# Altium project CUv4.PrjPcb
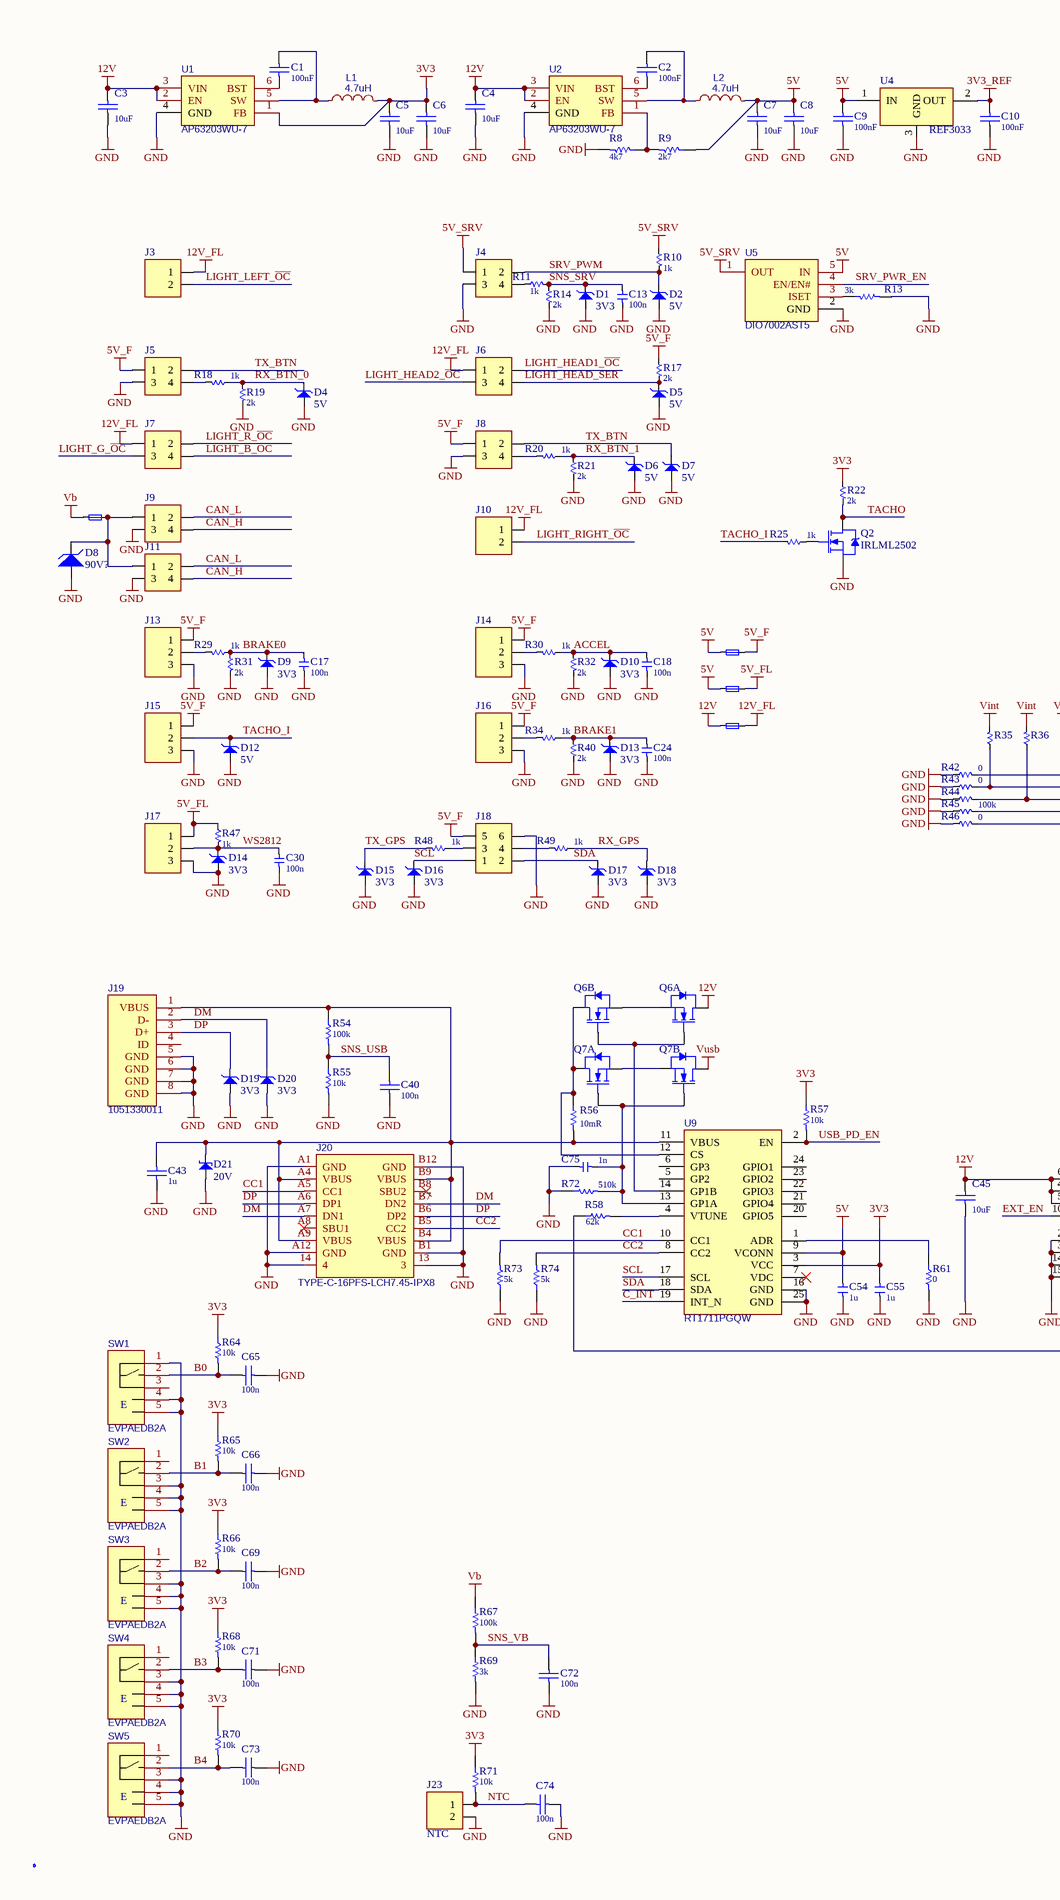
[diagram p0: schematic.SchDoc, left]
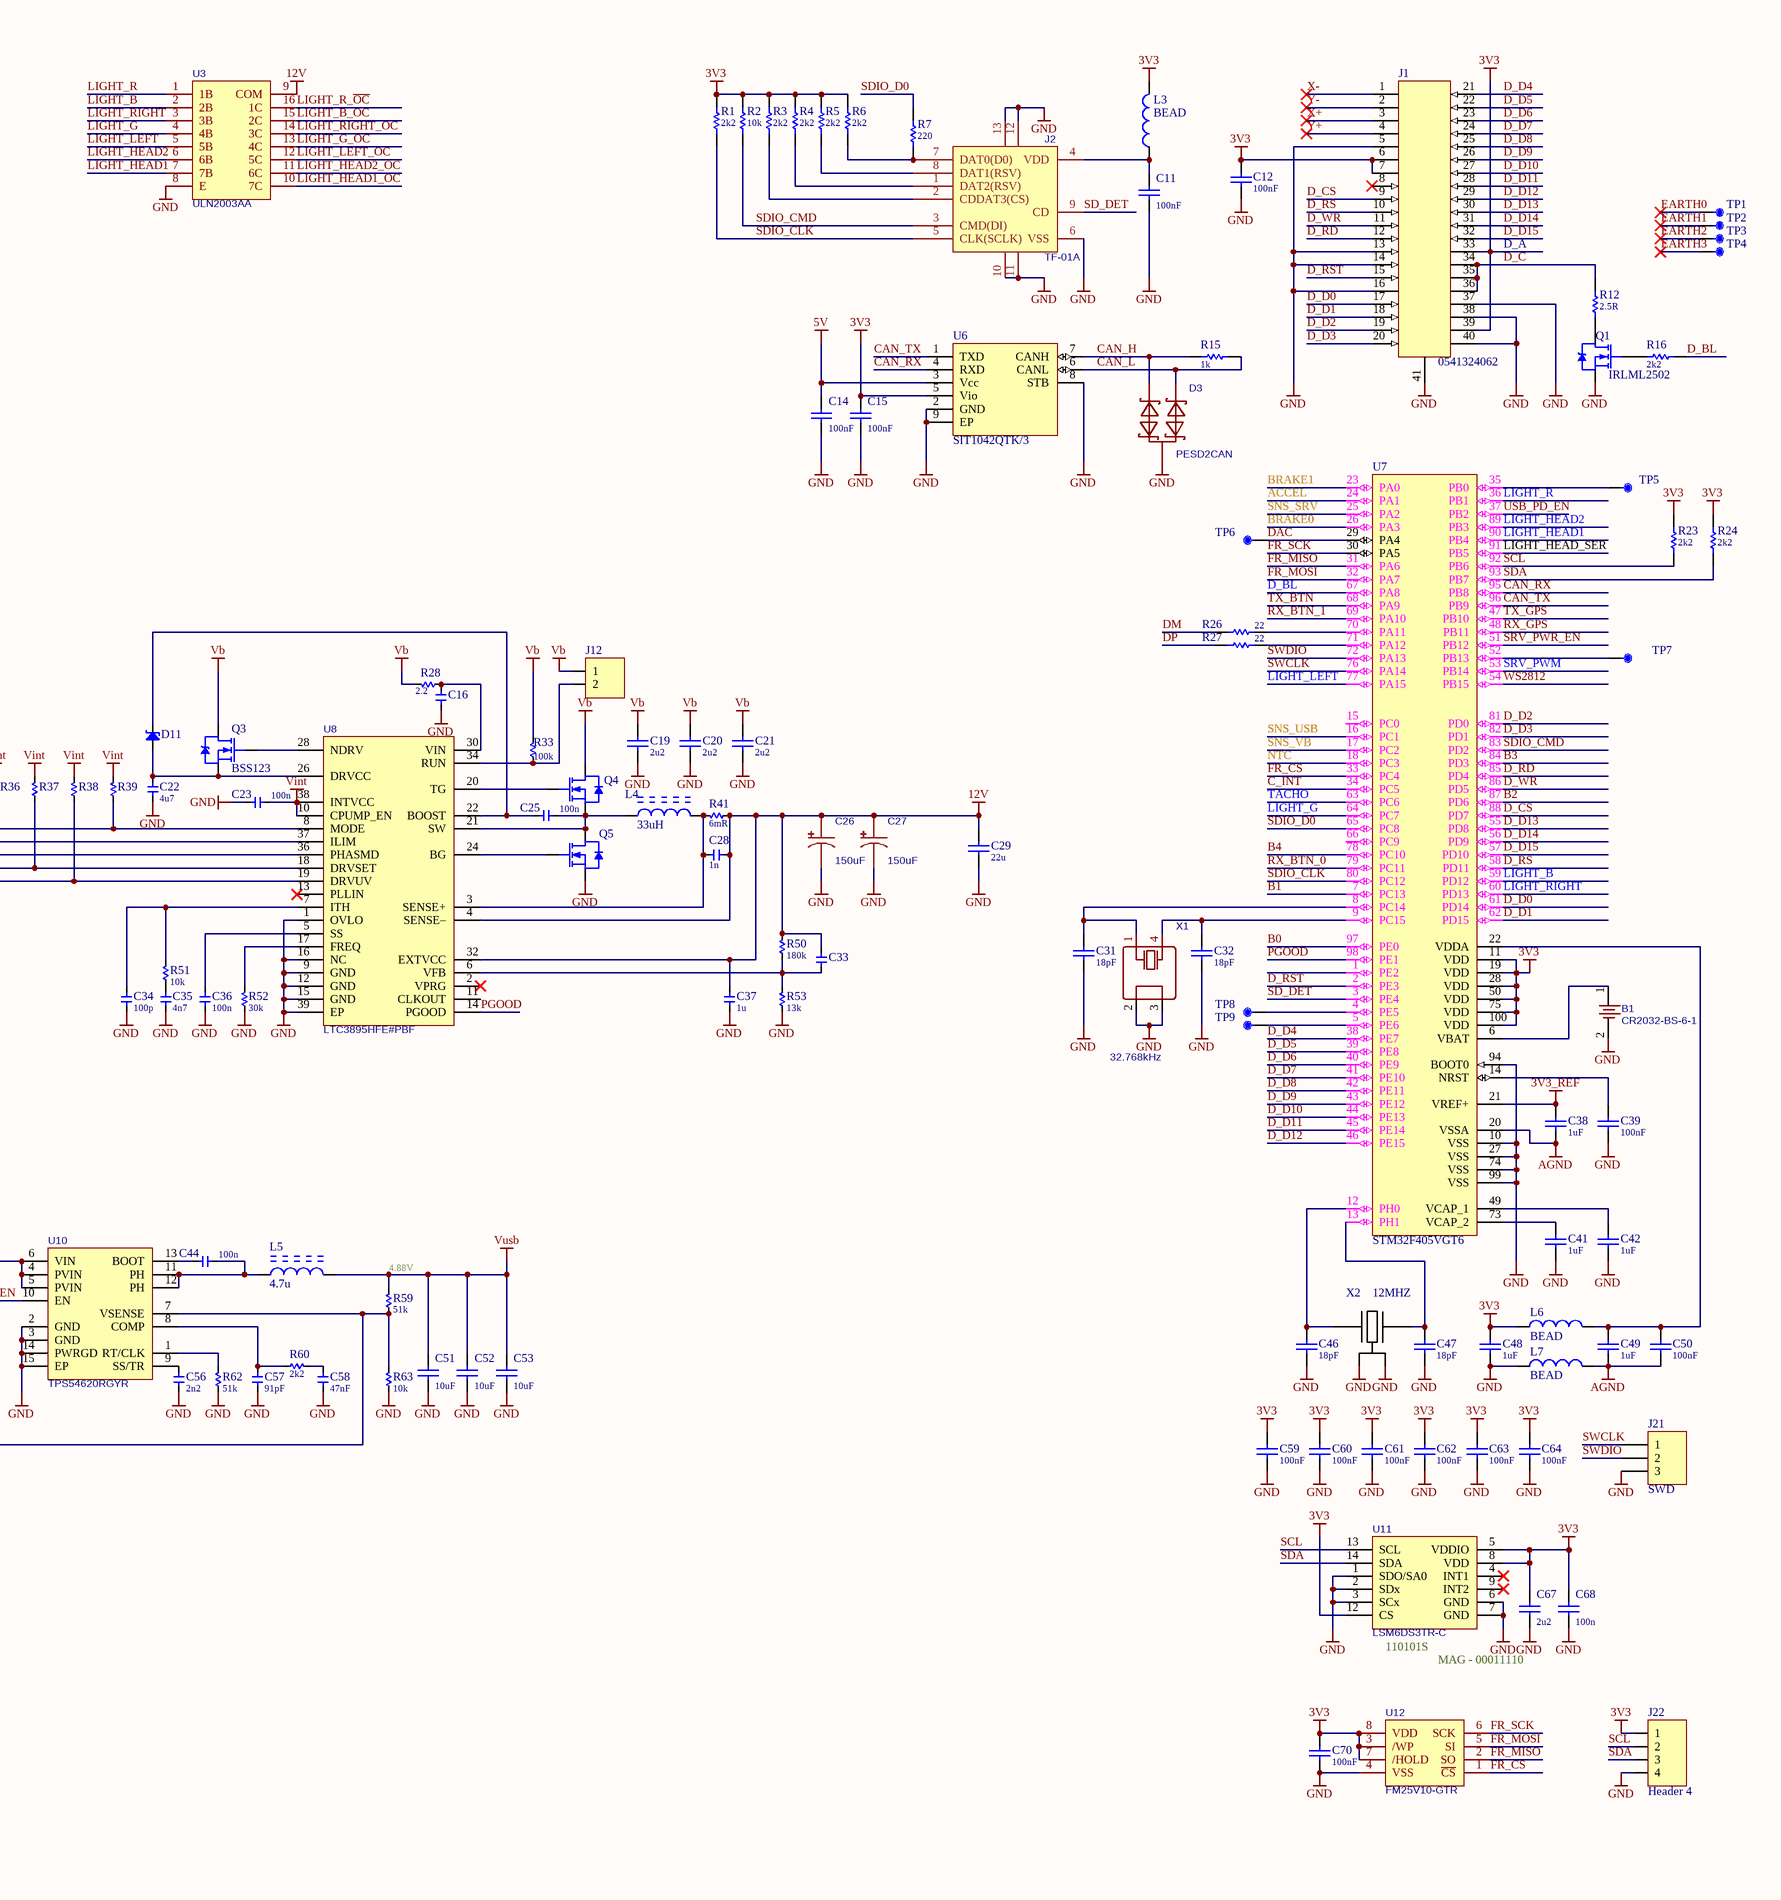
[diagram p1: schematic.SchDoc, right]
PRJ_ID: CU; PRJ_VER: v4.0.0
1 sheet, 241 parts. Net scope: global (net labels, ports and power ports of the same name join across sheets).
Board file: board.PcbDoc

## Sheet schematic.SchDoc
size A2

### Parts
B1  CR2032-BS-6-1  [BAT-TH_CR2032-BS-6-1]
C1  100nF  [C0402]
C2  100nF  [C0402]
C3  10uF  [C1206]
C4  10uF  [C1206]
C5  10uF  [C1206]
C6  10uF  [C1206]
C7  10uF  [C1206]
C8  10uF  [C1206]
C9  100nF  [C0603]
C10  100nF  [C0603]
C11  100nF  [C0402]
C12  100nF  [C0402]
C13  100n  [C0402]
C14  100nF  [C0402]
C15  100nF  [C0402]
C16  (no value)  [C0805]
C17  100n  [C0402]
C18  100n  [C0402]
C19  2u2  [C1210]
C20  2u2  [C1210]
C21  2u2  [C1210]
C22  4u7  [C0805]
C23  100n  [C0603]
C24  100n  [C0402]
C25  100n  [C0603]
C26  150uF  [C7343]
C27  150uF  [C7343]
C28  1n  [C0402]
C29  22u  [C1210]
C30  100n  [C0402]
C31  18pF  [C0402]
C32  18pF  [C0402]
C33  (no value)  [C0402]  (no BOM)
C34  100p  [C0402]
C35  4n7  [C0402]
C36  100n  [C0402]
C37  1u  [C0805]
C38  1uF  [C0603]
C39  100nF  [C0402]
C40  100n  [C0402]
C41  1uF  [C0603]
C42  1uF  [C0603]
C43  1u  [C0603]
C44  100n  [C0402]
C45  10uF  [C1206]
C46  18pF  [C0402]
C47  18pF  [C0402]
C48  1uF  [C0603]
C49  1uF  [C0603]
C50  100nF  [C0402]
C51  10uF  [C1206]
C52  10uF  [C1206]
C53  10uF  [C1206]
C54  1u  [C0402]
C55  1u  [C0402]
C56  2n2  [C0402]
C57  91pF  [C0402]
C58  47nF  [C0402]
C59  100nF  [C0402]
C60  100nF  [C0402]
C61  100nF  [C0402]
C62  100nF  [C0402]
C63  100nF  [C0402]
C64  100nF  [C0402]
C65  100n  [C0402]
C66  100n  [C0402]
C67  2u2  [C0603]
C68  100n  [C0603]
C69  100n  [C0402]
C70  100nF  [C0402]
C71  100n  [C0402]
C72  100n  [C0402]
C73  100n  [C0402]
C74  100n  [C0402]
C75  1n  [C0603]
D1  3V3  [SOD-323]
D2  5V  [SOD-323]
D3  PESD2CAN  [SOT-23]
D4  5V  [SOD-323]
D5  5V  [SOD-323]
D6  5V  [SOD-323]
D7  5V  [SOD-323]
D8  90V?  [SMC]
D9  3V3  [SOD-323]
D10  3V3  [SOD-323]
D11  1N4148WS  [SOD-323]  (value not drawn)
D12  5V  [SOD-323]
D13  3V3  [SOD-323]
D14  3V3  [SOD-323]
D15  3V3  [SOD-323]
D16  3V3  [SOD-323]
D17  3V3  [SOD-323]
D18  3V3  [SOD-323]
D19  3V3  [SOD-323]
D20  3V3  [SOD-323]
D21  20V  [SMA]
F1  1A  [FUSE-1206]  (value not drawn)
F2  1A  [FUSE-1206]  (value not drawn)
F3  1A  [FUSE-1206]  (value not drawn)
F4  2A  [FUSE-1206]  (value not drawn)
J1  0541324062  [*MOLEX_0541324062]
J2  TF-01A  [TF-SMD_TF-01A]
J3  (no value)  [HDR-1X2_2.54]  (no BOM)
J4  (no value)  [HDR-2X2_2.54]  (no BOM)
J5  (no value)  [HDR-2X2_2.54]  (no BOM)
J6  (no value)  [HDR-2X2_2.54]  (no BOM)
J7  (no value)  [HDR-2X2_2.54]  (no BOM)
J8  (no value)  [HDR-2X2_2.54]  (no BOM)
J9  (no value)  [HDR-2X2_2.54]  (no BOM)
J10  (no value)  [HDR-1X2_2.54]  (no BOM)
J11  (no value)  [HDR-2X2_2.54]  (no BOM)
J12  (no value)  [HDR-1x2-P1.25]  (no BOM)
J13  (no value)  [HDR-1X3_2.54]  (no BOM)
J14  (no value)  [HDR-1X3_2.54]  (no BOM)
J15  (no value)  [HDR-1X3_2.54]  (no BOM)
J16  (no value)  [HDR-1X3_2.54]  (no BOM)
J17  (no value)  [HDR-1X3_2.54]  (no BOM)
J18  (no value)  [HDR-2X3_2.54]  (no BOM)
J19  1051330011  [MICRO-USB-SMD_1051330011+]
J20  TYPE-C-16PFS-LCH7.45-IPX8  [USB-TH_TYPE-C-16PFS-LCH7.45-IPX8]
J21  SWD  [HDR-1x3-P1.25]  (no BOM)
J22  Header 4  [HDR-1x4-P1.25]  (no BOM)
J23  NTC  [HDR-1x2-P1.25]  (no BOM)
L1  4.7uH  [IND-SMD_L4.4-W4.2]
L2  4.7uH  [IND-SMD_L4.4-W4.2]
L3  BEAD  [L0603]
L4  33uH  [IND_10X11.5MM]
L5  4.7u  [IND-SMD_L7.2-W6.6_GPSR07X0]
L6  BEAD  [L0402]
L7  BEAD  [L0402]
LOGO1  LOGO  [LOGO]  (value not drawn)  (no BOM)
Q1  IRLML2502  [SOT-23]
Q2  IRLML2502  [SOT-23]
Q3  BSS123  [SOT-23]
Q4  AOD66923  [TO-252AA (DPAK)]  (value not drawn)
Q5  AOD66923  [TO-252AA (DPAK)]  (value not drawn)
Q6  4884  [SO-8]  (value not drawn)  (parts A,B of 2)
Q7  4884  [SO-8]  (value not drawn)  (parts A,B of 2)
R1  2k2  [R0603]
R2  10k  [R0603]
R3  2k2  [R0603]
R4  2k2  [R0603]
R5  2k2  [R0603]
R6  2k2  [R0603]
R7  220  [R0603]
R8  4k7  [R0603]
R9  2k7  [R0603]
R10  1k  [R0402]
R11  1k  [R0402]
R12  2.5R  [R0805]
R13  3k  [R0402]
R14  2k  [R0402]
R15  1k  [R1206]
R16  2k2  [R0402]
R17  2k  [R0402]
R18  1k  [R0402]
R19  2k  [R0402]
R20  1k  [R0402]
R21  2k  [R0402]
R22  2k  [R0402]
R23  2k2  [R0402]
R24  2k2  [R0402]
R25  1k  [R0402]
R26  22  [R0603]
R27  22  [R0603]
R28  2.2  [R0603]
R29  1k  [R0402]
R30  1k  [R0402]
R31  2k  [R0402]
R32  2k  [R0402]
R33  100k  [R0603]
R34  1k  [R0402]
R35  (no value)  [R0603]  (no BOM)
R36  (no value)  [R0603]  (no BOM)
R37  (no value)  [R0603]  (no BOM)
R38  (no value)  [R0603]  (no BOM)
R39  (no value)  [R0603]  (no BOM)
R40  2k  [R0402]
R41  6mR  [R2512-WIDE]
R42  0  [R0603]
R43  0  [R0603]
R44  (no value)  [R0603]  (no BOM)
R45  100k  [R0603]
R46  0  [R0603]
R47  1k  [R0402]
R48  1k  [R0402]
R49  1k  [R0402]
R50  180k  [R0603]
R51  10k  [R0603]
R52  30k  [R0603]
R53  13k  [R0603]
R54  100k  [R0603]
R55  10k  [R0603]
R56  10mR  [R1206]
R57  10k  [R0402]
R58  62k  [R0402]
R59  51k  [R0603]
R60  2k2  [R0402]
R61  0  [R0402]
R62  51k  [R0603]
R63  10k  [R0603]
R64  10k  [R0402]
R65  10k  [R0402]
R66  10k  [R0402]
R67  100k  [R0603]
R68  10k  [R0402]
R69  3k  [R0402]
R70  10k  [R0402]
R71  10k  [R0402]
R72  510k  [R0603]
R73  5k  [R0603]
R74  5k  [R0603]
SW1  EVPAEDB2A  [KEY-SMD_EVPAEBB2A]
SW2  EVPAEDB2A  [KEY-SMD_EVPAEBB2A]
SW3  EVPAEDB2A  [KEY-SMD_EVPAEBB2A]
SW4  EVPAEDB2A  [KEY-SMD_EVPAEBB2A]
SW5  EVPAEDB2A  [KEY-SMD_EVPAEBB2A]
TP1  (no value)  [TP30_SMD]  (no BOM)
TP2  (no value)  [TP30_SMD]  (no BOM)
TP3  (no value)  [TP30_SMD]  (no BOM)
TP4  (no value)  [TP30_SMD]  (no BOM)
TP5  (no value)  [TP30_SMD]  (no BOM)
TP6  (no value)  [TP30_SMD]  (no BOM)
TP7  (no value)  [TP30_SMD]  (no BOM)
TP8  (no value)  [TP30_SMD]  (no BOM)
TP9  (no value)  [TP30_SMD]  (no BOM)
U1  AP63203WU-7  [SOT-23-6]
U2  AP63203WU-7  [SOT-23-6]
U3  ULN2003AA  [SOIC-16]
U4  REF3033  [SOT-23]
U5  DIO7002AST5  [SOT-23-5]
U6  SIT1042QTK/3  [DFN8_3X3_P065]
U7  STM32F405VGT6  [*QFP50P1600X1600X160-100N]
U8  LTC3895HFE#PBF  [TSSOP-38_L9.7-W4.4-P0.50-LS6.4-BL-EP-PE]
U9  RT1711PGQW  [TQFN-24_L3.5-W3.5-P0.40-TL-EP2.0]
U10  TPS54620RGYR  [VQFN-14_L3.5-W3.5-P0.50-BL-EP_TPS54622RHLT]
U11  LSM6DS3TR-C  [LGA-14_L3.0-W2.5-P0.50-TL]
U12  FM25V10-GTR  [SOIC-8]
X1  32.768kHz  [MC-146]
X2  12MHZ  [CRYSTAL_3.2x2.5mm]

### Nets
3V3: C5.2 C6.2 C12.2 C15.2 C48.2 C55.1 C59.2 C60.2 C61.2 C62.2 C63.2 C64.2 C67.1 C68.1 C70.2 J1.6 J1.7 J1.33 J1.39 J22.1 L1.2 L3.1 L6.1 R1.2 R2.2 R3.2 R4.2 R5.2 R6.2 R22.2 R23.2 R24.2 R57.1 R64.1 R65.1 R66.1 R68.1 R70.1 R71.1 U1.1(FB) U6.5(Vio) U7.11(VDD) U7.19(VDD) U7.28(VDD) U7.50(VDD) U7.75(VDD) U7.100(VDD) U9.3(VCC) U11.5(VDDIO) U11.8(VDD) U11.12(CS) U12.3(/WP) U12.7(/HOLD) U12.8(VDD)
3V3_REF: C10.2 C38.2 U4.2(OUT) U7.21(VREF+)
5V: C7.2 C8.2 C9.2 C14.2 C54.1 F2.1 F3.1 L2.2 R9.1 U4.1(IN) U5.5(IN) U6.3(Vcc) U9.9(VCONN)
5V_F: F2.2 J5.1 J8.1 J13.1 J14.1 J15.1 J16.1 J18.5 R17.2
5V_FL: F3.2 J17.1 R47.2
5V_SRV: J4.1 R10.2 U5.1(OUT)
12V: C3.2 C4.2 C26.1 C27.1 C28.1 C29.2 C33.1 C37.1 C45.2 F4.1 Q6.7,8(D1) R41.2 R50.1 U1.2(EN) U1.3(VIN) U2.2(EN) U2.3(VIN) U3.9(COM) U8.4(SENSE–) U8.32(EXTVCC) U10.4(PVIN) U10.5(PVIN) U10.6(VIN)
12V_FL: F4.2 J3.1 J6.1 J7.1 J10.1
AGND: C38.1 C49.1 C50.1 L7.2 U7.20(VSSA)
GND: B1.2 C3.1 C4.1 C5.1 C6.1 C7.1 C8.1 C9.1 C10.1 C11.1 C12.1 C13.1 C14.1 C15.1 C16.2 C17.1 C18.1 C19.1 C20.1 C21.1 C22.2 C23.1 C24.1 C26.2 C27.2 C29.1 C30.1 C31.1 C32.1 C34.2 C35.2 C36.2 C37.2 C39.1 C40.1 C41.1 C42.1 C43.1 C45.1 C46.1 C47.1 C48.1 C51.1 C52.1 C53.1 C54.2 C55.2 C56.2 C57.2 C58.2 C59.1 C60.1 C61.1 C62.1 C63.1 C64.1 C65.2 C66.2 C67.2 C68.2 C69.2 C70.1 C71.2 C72.1 C73.2 C74.1 C75.1 D1.1(-) D2.1(-) D3.3 D4.1(-) D5.1(-) D6.1(-) D7.1(-) D8.1(A) D9.1(-) D10.1(-) D12.1(-) D13.1(-) D14.1(-) D15.1(-) D16.1(-) D17.1(-) D18.1(-) D19.1(-) D20.1(-) D21.1(-) J1.5 J1.13 J1.14 J1.16 J1.37 J1.38 J1.40 J1.41 J2.6(VSS) J2.10(GND) J2.11(GND) J2.12(GND) J2.13(GND) J4.3 J5.3 J8.3 J9.3 J11.3 J13.3 J14.3 J15.3 J16.3 J17.3 J18.6 J19.5(GND) J19.6(GND) J19.7(GND) J19.8(GND) J20.13(3) J20.14(4) J20.A1(GND) J20.A12(GND) J20.B1(GND) J20.B12(GND) J21.3 J22.4 J23.2 L7.1 Q1.2(S) Q2.2(S) Q5.3(SOURCE) R8.2 R13.2 R14.1 R19.1 R21.1 R31.1 R32.1 R40.1 R42.2 R43.2 R44.2 R45.2 R46.2 R52.2 R53.2 R55.2 R61.2 R62.1 R63.2 R69.2 R72.1 R73.1 R74.1 SW1.1 SW1.4 SW1.5 SW2.3 SW2.4 SW2.5 SW3.3 SW3.4 SW3.5 SW4.3 SW4.4 SW4.5 SW5.3 SW5.4 SW5.5 U1.4(GND) U2.4(GND) U3.8(E) U4.3(GND) U5.2(GND) U6.2(GND) U6.8(STB) U6.9(EP) U7.10(VSS) U7.27(VSS) U7.74(VSS) U7.94(BOOT0) U7.99(VSS) U8.1(OVLO) U8.9(GND) U8.12(GND) U8.15(GND) U8.16(NC) U8.39(EP) U9.16(GND) U9.25(GND) U10.2(GND) U10.3(GND) U10.14(PWRGD) U10.15(EP) U11.1(SDO/SA0) U11.2(SDx) U11.3(SCx) U11.6(GND) U11.7(GND) U12.4(VSS) X1.2 X1.3 X2.2(GND) X2.4(GND)
Vb: C19.2 C20.2 C21.2 F1.1 J12.1 Q3.3(D) Q4.2(DRAIN) R28.1 R33.1 R67.1
Vint: C23.2 R35.1 R36.1 R37.1 R38.1 R39.1 U8.10(CPUMP_EN) U8.38(INTVCC)
Vusb: C51.2 C52.2 C53.2 L5.2 Q7.5,6(D2) R59.1
ACCEL: C18.2 D10.2(+) R30.2 R32.2 U7.24(PA1)
B0: C65.1 R64.2 SW1.2 U7.97(PE0)
B1: C66.1 R65.2 SW2.2 U7.7(PC13)
B2: C69.1 R66.2 SW3.2 U7.87(PD6)
B3: C71.1 R68.2 SW4.2 U7.84(PD3)
B4: C73.1 R70.2 SW5.2 U7.78(PC10)
BRAKE0: C17.2 D9.2(+) R29.2 R31.2 U7.26(PA3)
BRAKE1: C24.2 D13.2(+) R34.2 R40.2 U7.23(PA0)
C_INT: U7.34(PC5) U9.19(INT_N)
CAN_H: D3.1 J9.4 J11.4 R15.2 U6.7(CANH)
CAN_L: D3.2 J9.2 J11.2 R15.1 U6.6(CANL)
CAN_RX: U6.4(RXD) U7.95(PB8)
CAN_TX: U6.1(TXD) U7.96(PB9)
CC1: J20.A5(CC1) R73.2 U9.10(CC1)
CC2: J20.B5(CC2) R74.2 U9.8(CC2)
D_BL: R16.1 U7.67(PA8)
D_C: J1.34 J1.35 J1.36 R12.1
D_CS: J1.9 U7.88(PD7)
D_D0: J1.17 U7.61(PD14)
D_D1: J1.18 U7.62(PD15)
D_D2: J1.19 U7.81(PD0)
D_D3: J1.20 U7.82(PD1)
D_D4: J1.21 U7.38(PE7)
D_D5: J1.22 U7.39(PE8)
D_D6: J1.23 U7.40(PE9)
D_D7: J1.24 U7.41(PE10)
D_D8: J1.25 U7.42(PE11)
D_D9: J1.26 U7.43(PE12)
D_D10: J1.27 U7.44(PE13)
D_D11: J1.28 U7.45(PE14)
D_D12: J1.29 U7.46(PE15)
D_D13: J1.30 U7.55(PD8)
D_D14: J1.31 U7.56(PD9)
D_D15: J1.32 U7.57(PD10)
D_RD: J1.12 U7.85(PD4)
D_RS: J1.10 U7.58(PD11)
D_RST: J1.15 U7.2(PE3)
D_WR: J1.11 U7.86(PD5)
DAC: TP6.1 U7.29(PA4)
DM: D20.2(+) J19.2(D-) J20.A7(DN1) J20.B7(DN2) R26.2
DP: D19.2(+) J19.3(D+) J20.A6(DP1) J20.B6(DP2) R27.2
EARTH0: TP1.1
EARTH1: TP2.1
EARTH2: TP3.1
EARTH3: TP4.1
EXT_EN: U10.10(EN)
FR_CS: U7.33(PC4) U12.1(~{CS})
FR_MISO: U7.31(PA6) U12.2(SO)
FR_MOSI: U7.32(PA7) U12.5(SI)
FR_SCK: U7.30(PA5) U12.6(SCK)
LIGHT_B: U3.2(2B) U7.59(PD12)
LIGHT_B_~{OC}: J7.4 U3.15(2C)
LIGHT_G: U3.4(4B) U7.64(PC7)
LIGHT_G_~{OC}: J7.3 U3.13(4C)
LIGHT_HEAD1: U3.7(7B) U7.90(PB4)
LIGHT_HEAD1_~{OC}: J6.2 U3.10(7C)
LIGHT_HEAD2: U3.6(6B) U7.89(PB3)
LIGHT_HEAD2_~{OC}: J6.3 U3.11(6C)
LIGHT_HEAD_SER: D5.2(+) J6.4 R17.1 U7.91(PB5)
LIGHT_LEFT: U3.5(5B) U7.77(PA15)
LIGHT_LEFT_~{OC}: J3.2 U3.12(5C)
LIGHT_R: U3.1(1B) U7.36(PB1)
LIGHT_R_~{OC}: J7.2 U3.16(1C)
LIGHT_RIGHT: U3.3(3B) U7.60(PD13)
LIGHT_RIGHT_~{OC}: J10.2 U3.14(3C)
NTC: C74.2 J23.1 R71.2 U7.18(PC3)
PGOOD: U7.98(PE1) U8.14(PGOOD)
RX_BTN_0: D4.2(+) R18.2 R19.2 U7.79(PC11)
RX_BTN_1: D6.2(+) R20.2 R21.2 U7.69(PA10)
RX_GPS: D18.2(+) R49.2 U7.48(PB11)
SCL: D16.2(+) J18.1 J22.2 R23.1 U7.92(PB6) U9.17(SCL) U11.13(SCL)
SD_DET: J2.9(CD) U7.3(PE4)
SDA: D17.2(+) J18.2 J22.3 R24.1 U7.93(PB7) U9.18(SDA) U11.14(SDA)
SDIO_CLK: J2.5(CLK(SCLK)) R1.1 U7.80(PC12)
SDIO_CMD: J2.3(CMD(DI)) R2.1 U7.83(PD2)
SDIO_D0: R7.2 U7.65(PC8)
SNS_SRV: C13.2 D1.2(+) R11.1 R14.2 U7.25(PA2)
SNS_USB: C40.2 R54.2 R55.1 U7.16(PC1)
SNS_VB: C72.2 R67.2 R69.1 U7.17(PC2)
SRV_PWM: D2.2(+) J4.2 R10.1 U7.53(PB14)
SRV_PWR_EN: U5.4(EN/EN#) U7.51(PB12)
SWCLK: J21.1 U7.76(PA14)
SWDIO: J21.2 U7.72(PA13)
TACHO: Q2.3(D) R22.1 U7.63(PC6)
TACHO_I: D12.2(+) J15.2 R25.1
TX_BTN: D7.2(+) J5.2 J8.2 U7.68(PA9)
TX_GPS: D15.2(+) R48.1 U7.47(PB10)
USB_PD_EN: R57.2 U7.37(PB2) U9.2(EN)
WS2812: C30.2 D14.2(+) J17.2 R47.1 U7.54(PB15)
X+: J1.3
X-: J1.1
Y+: J1.4
Y-: J1.2
NetB1_1: B1.1 U7.6(VBAT)
NetC1_1: C1.1 U1.6(BST)
NetC1_2: C1.2 L1.1 U1.5(SW)
NetC2_1: C2.1 U2.6(BST)
NetC2_2: C2.2 L2.1 U2.5(SW)
NetC11_2: C11.2 J2.4(VDD) L3.2
NetC16_1: C16.1 R28.2 U8.30(VIN)
NetC22_1: C22.1 D11.1(-) Q3.2(S) U8.26(DRVCC)
NetC25_1: C25.1 L4.1 Q4.3(SOURCE) Q5.2(DRAIN) U8.21(SW)
NetC25_2: C25.2 D11.2(+) U8.22(BOOST)
NetC28_2: C28.2 L4.2 R41.1 U8.3(SENSE+)
NetC31_2: C31.2 U7.8(PC14) X1.1(OSC1)
NetC32_2: C32.2 U7.9(PC15) X1.4(OSC2)
NetC33_2: C33.2 R50.2 R53.1 U8.6(VFB)
NetC34_1: C34.1 R51.1 U8.7(ITH)
NetC35_1: C35.1 R51.2
NetC36_1: C36.1 U8.5(SS)
NetC39_2: C39.2 U7.14(NRST)
NetC41_2: C41.2 U7.73(VCAP_2)
NetC42_2: C42.2 U7.49(VCAP_1)
NetC43_2: C43.2 D21.2(+) J19.1(VBUS) J20.A4(VBUS) J20.A9(VBUS) J20.B4(VBUS) J20.B9(VBUS) R54.1 R56.2 U9.11(VBUS)
NetC44_1: C44.1 L5.1 U10.11(PH) U10.12(PH)
NetC44_2: C44.2 U10.13(BOOT)
NetC46_2: C46.2 U7.12(PH0) X2.3(X2)
NetC47_2: C47.2 U7.13(PH1) X2.1(X1)
NetC49_2: C49.2 C50.2 L6.2 U7.22(VDDA)
NetC56_1: C56.1 U10.9(SS/TR)
NetC57_1: C57.1 R60.1 U10.8(COMP)
NetC58_1: C58.1 R60.2
NetC75_2: C75.2 Q7.2(G1) Q7.4(G2) R72.2 U9.13(GP1A)
NetD8_2: D8.2(K) F1.2 J9.1 J11.1
NetJ2_1: J2.1(DAT2(RSV)) R4.1
NetJ2_2: J2.2(CDDAT3(CS)) R3.1
NetJ2_7: J2.7(DAT0(D0)) R6.1 R7.1
NetJ2_8: J2.8(DAT1(RSV)) R5.1
NetJ4_4: J4.4 R11.2
NetJ5_4: J5.4 R18.1
NetJ8_4: J8.4 R20.1
NetJ12_2: J12.2 R33.2 U8.34(RUN)
NetJ13_2: J13.2 R29.1
NetJ14_2: J14.2 R30.1
NetJ16_2: J16.2 R34.1
NetJ18_3: J18.3 R48.2
NetJ18_4: J18.4 R49.1
NetQ1_1: Q1.1(G) R16.2
NetQ1_3: Q1.3(D) R12.2
NetQ2_1: Q2.1(G) R25.2
NetQ3_1: Q3.1(G) U8.28(NDRV)
NetQ4_1: Q4.1(GATE) U8.20(TG)
NetQ5_1: Q5.1(GATE) U8.24(BG)
NetQ6_1: Q6.1(S1) Q6.3(S2)
NetQ6_2: Q6.2(G1) Q6.4(G2) U9.14(GP1B)
NetQ6_5,6: Q6.5,6(D2) Q7.7,8(D1) R56.1 U9.12(CS)
NetQ7_1: Q7.1(S1) Q7.3(S2)
NetR8_1: R8.1 R9.2 U2.1(FB)
NetR13_1: R13.1 U5.3(ISET)
NetR26_1: R26.1 U7.70(PA11)
NetR27_1: R27.1 U7.71(PA12)
NetR35_2: R35.2 R43.1 U8.37(ILIM)
NetR36_2: R36.2 R44.1 U8.36(PHASMD)
NetR37_2: R37.2 R45.1 U8.18(DRVSET)
NetR38_2: R38.2 R46.1 U8.19(DRVUV)
NetR39_2: R39.2 R42.1 U8.8(MODE)
NetR52_1: R52.1 U8.17(FREQ)
NetR58_1: R58.1 R59.2 R63.1 U10.7(VSENSE)
NetR58_2: R58.2 U9.4(VTUNE)
NetR61_1: R61.1 U9.1(ADR)
NetR62_2: R62.2 U10.1(RT/CLK)
NetTP5_1: TP5.1 U7.35(PB0)
NetTP7_1: TP7.1 U7.52(PB13)
NetTP8_1: TP8.1 U7.4(PE5)
NetTP9_1: TP9.1 U7.5(PE6)

Not connected (* = marked no-connect by the designer): J1 8*; J19 4(ID); J20 A8(SBU1)* B8(SBU2)*; SW1 3; SW2 1; SW3 1; SW4 1; SW5 1; U7 1(PE2) 15(PC0) 66(PC9); U8 2(VPRG)* 11(CLKOUT) 13(PLLIN)*; U9 5(GP2) 6(GP3) 7(VDC)* 20(GPIO5) 21(GPIO4) 22(GPIO3) 23(GPIO2) 24(GPIO1); U11 4(INT1)* 9(INT2)*

### Notes on the sheet
- D_A
- (near R59) 4.88V
- (near U11) 110101S
- (near U11) MAG - 00011110
- Title
- Size:
- Date:
- File:
- A2
- Number:
- Time:
- Revision:
- Sheet
- of
- (in symbol EVPAEDB2A) E

### Library data of the parts
C1 C2 C11 C19-C21 C40 C43 C65-C69 C71-C75 = CAP
C3-C8 C13 C16-C18 C22-C25 C28 C30 C33-C37 C44 C45 C51-C58 = CAP: P/N: CL31B106KBHNNNE; LCSC part number: C89632
C9 C10 C12 = CAP: P/N: 0603B104K500NT; LCSC part number: C30926
C14 C15 C39 C50 C59-C64 C70 = CAP: P/N: CC0402KRX7R9BB104; LCSC part number: C131394
C26 C27 = 220uF
C29 = CAP: 22u 35V 1210; P/N: GMK325BJ226MM-P; LCSC part number: C778721
C31 C32 C46 C47 = CAP: P/N: GRM1555C1H180JA01D; LCSC part number: C33149
C38 C41 C42 C48 C49 = CAP: P/N: 0603B105K500NT; LCSC part number: C90540
D1 D9 D10 D12-D20 = NCP51460SN33T1G: SD03; P/N: SMCJ24A; LCSC part number: C693617
D2 D4-D7 = NCP51460SN33T1G: SD05; P/N: SMCJ24A; LCSC part number: C693617
D3 = CDSOT23-SM712: LCSC part number: C5261081; P/N: PESD2CAN
D8 = SMCJ54A: LCSC part number: C720068; P/N: SMCJ54A
D11 D21 = NCP51460SN33T1G: P/N: SMCJ24A; LCSC part number: C693617
F1-F4 = Fuse 1: P/N: TLC-LSMD075/60; LCSC part number: C2924950
J1 = 0541324062: Conn FPC Connector SKT 40 POS 0.5mm Solder RA SMD Easy-OnГўВ„Вў T/R
J3-J12 J18 J23 = Header 2
J13-J17 J21 J22 = Header 3
J20 = TYPE-C 16PFS LCH7.45 IPX8: P/N: 16PFS LCH7.45 IPX8; LCSC part number: C3020054
L1 L2 = 4.7uH: P/N: FXL0420-4R7-M; LCSC part number: C167208
L3 = BLM18AG601SN1D
L4 = SRN3015-100M: FXL1050-330-M
L5 = SRN3015-100M: CYA0630-4.7UH; P/N: CYA0630-10UH; LCSC part number: C5189958
L6 L7 = BLM18AG601SN1D: P/N: CBG100505U600T; LCSC part number: C92615
Q1-Q3 = IRLML2402
Q4 Q5 = 2N7002
R1-R6 R54 R55 R57 R58 R61 R64-R74 = RES_0402_1K5-1%
R7-R11 R14-R53 R56 R59 R60 R62 R63 = RES
R12 = RES: 2.5R = 10R x4
R13 = R0201: P/N: 0402WGF3001TCE; LCSC part number: C25784
TP1-TP9 = TP_Dup1
U3 = ULN2003A: P/N: ULN2003A; LCSC part number: C181730
U4 = NCP51460SN33T1G: REF3033AIDBZR; LCSC part number: C36658; P/N: REF3033AIDBZR
U6 = LTC2875: IC INTERFACE CAN; LCSC part number: C5308062; P/N: SIT1042QTK/3
U7 = Component_1_1
X1 = 32.768kHz: P/N: Q13MC1461000400_C397823; LCSC part number: *
X2 = CRYSTAL 12MHZ 3.20mm x 2.50mm: P/N: X322512MOB4SI; LCSC part number: C70565
B1 = CR2032-BS-6-1: P/N: CR2032-BS-6-1; LCSC part number: C70377
J19 = 1051330011: P/N: 1051330011; LCSC part number: C586226
SW1-SW5 = EVPAEDB2A: P/N: EVPAEDB2A; LCSC part number: C79150
U1 U2 = AP63203WU-7: P/N: AP63203WU-7; LCSC part number: C780769
U5 = DIO7002AST5: LCSC part number: C403840; P/N: DIO7002AST5
U8 = LTC3895HFE#PBF: P/N: LTC3895HFE#PBF; LCSC part number: C580817
U9 = RT1711PGQW: P/N: RT1711PGQW; LCSC part number: C3034209
U10 = TPS54620RGYR: P/N: TPS54620RGYR; LCSC part number: C29438
U11 = LSM6DS3TR-C: P/N: LSM6DS3TR-C; LCSC part number: C967633
U12 = FM25V10-GTR: P/N: FM25V10-GTR; LCSC part number: C44173